# Altium schematic sheet Digital_OUT.SchDoc: Digital outputs
size A3; Organization: ORGANIZATION; Address1: ADDRESS 1; Address2: ADDRESS 2; Address3: ADDRESS 3; Address4: ADDRESS 4; Revision: 0.0; SheetNumber: 10; SheetTotal: 19; ENG_APP_DATE: --/--/--; DSN_APP_DATE: --/--/--; CHK_APP_DATE: --/--/--
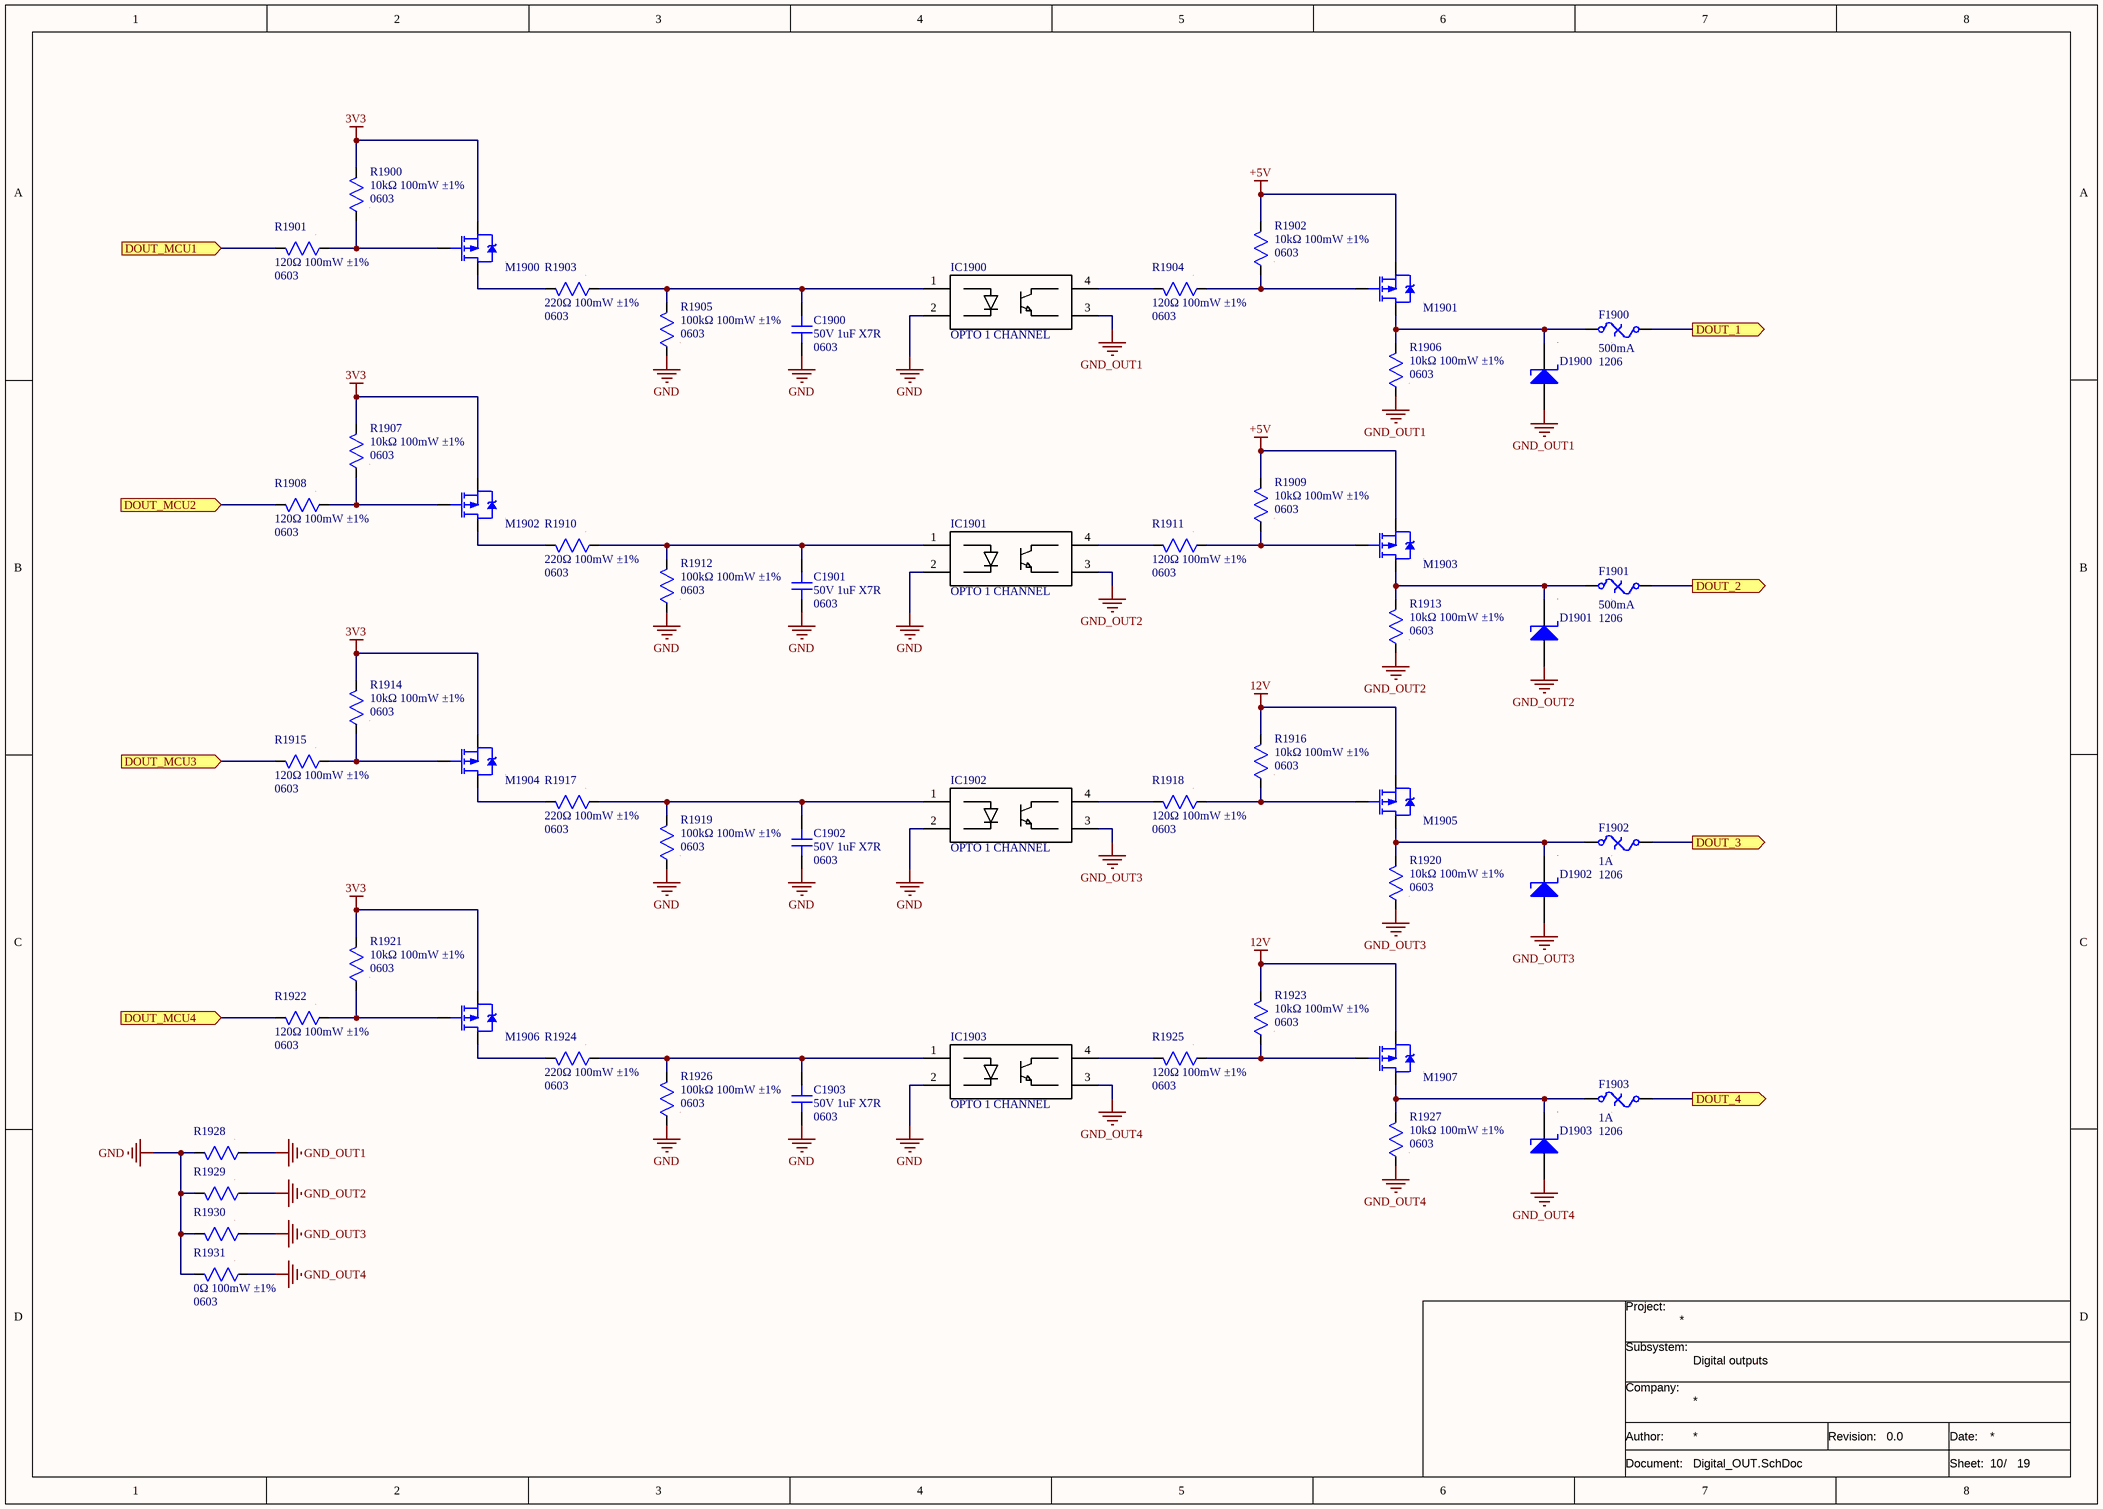
[diagram p0: Digital_OUT.SchDoc]

## Parts
C1900  value 50V 1uF X7R  Package: 0603  [CAP SMD 0603]  (hidden comment: CAP non polarized)
C1901  value 50V 1uF X7R  Package: 0603  [CAP SMD 0603]  (hidden comment: CAP non polarized)
C1902  value 50V 1uF X7R  Package: 0603  [CAP SMD 0603]  (hidden comment: CAP non polarized)
C1903  value 50V 1uF X7R  Package: 0603  [CAP SMD 0603]  (hidden comment: CAP non polarized)
D1900  DIODE SCHOTTKY  [DO-214AB]  (value not drawn)
D1901  DIODE SCHOTTKY  [DO-214AB]  (value not drawn)
D1902  DIODE SCHOTTKY  [DO-214AB]  (value not drawn)
D1903  DIODE SCHOTTKY  [DO-214AB]  (value not drawn)
F1900  value 500mA  Package: 1206  [FUSE SMD 1206]  (hidden comment: FUSE)
F1901  value 500mA  Package: 1206  [FUSE SMD 1206]  (hidden comment: FUSE)
F1902  value 1A  Package: 1206  [FUSE SMD 1206]  (hidden comment: FUSE)
F1903  value 1A  Package: 1206  [FUSE SMD 1206]  (hidden comment: FUSE)
IC1900  OPTO 1 CHANNEL  [SOIC-4]
IC1901  OPTO 1 CHANNEL  [SOIC-4]
IC1902  OPTO 1 CHANNEL  [SOIC-4]
IC1903  OPTO 1 CHANNEL  [SOIC-4]
M1900  MOSFET P  [SOT-23]  (value not drawn)
M1901  MOSFET P  [SOT-23]  (value not drawn)
M1902  MOSFET P  [SOT-23]  (value not drawn)
M1903  MOSFET P  [SOT-23]  (value not drawn)
M1904  MOSFET P  [SOT-23]  (value not drawn)
M1905  MOSFET P  [SOT-23]  (value not drawn)
M1906  MOSFET P  [SOT-23]  (value not drawn)
M1907  MOSFET P  [SOT-23]  (value not drawn)
R1900  value 10kΩ 100mW ±1%  Package: 0603  [RES SMD 0603]  (hidden comment: RES)
R1901  value 120Ω 100mW ±1%  Package: 0603  [RES SMD 0603]  (hidden comment: RES)
R1902  value 10kΩ 100mW ±1%  Package: 0603  [RES SMD 0603]  (hidden comment: RES)
R1903  value 220Ω 100mW ±1%  Package: 0603  [RES SMD 0603]  (hidden comment: RES)
R1904  value 120Ω 100mW ±1%  Package: 0603  [RES SMD 0603]  (hidden comment: RES)
R1905  value 100kΩ 100mW ±1%  Package: 0603  [RES SMD 0603]  (hidden comment: RES)
R1906  value 10kΩ 100mW ±1%  Package: 0603  [RES SMD 0603]  (hidden comment: RES)
R1907  value 10kΩ 100mW ±1%  Package: 0603  [RES SMD 0603]  (hidden comment: RES)
R1908  value 120Ω 100mW ±1%  Package: 0603  [RES SMD 0603]  (hidden comment: RES)
R1909  value 10kΩ 100mW ±1%  Package: 0603  [RES SMD 0603]  (hidden comment: RES)
R1910  value 220Ω 100mW ±1%  Package: 0603  [RES SMD 0603]  (hidden comment: RES)
R1911  value 120Ω 100mW ±1%  Package: 0603  [RES SMD 0603]  (hidden comment: RES)
R1912  value 100kΩ 100mW ±1%  Package: 0603  [RES SMD 0603]  (hidden comment: RES)
R1913  value 10kΩ 100mW ±1%  Package: 0603  [RES SMD 0603]  (hidden comment: RES)
R1914  value 10kΩ 100mW ±1%  Package: 0603  [RES SMD 0603]  (hidden comment: RES)
R1915  value 120Ω 100mW ±1%  Package: 0603  [RES SMD 0603]  (hidden comment: RES)
R1916  value 10kΩ 100mW ±1%  Package: 0603  [RES SMD 0603]  (hidden comment: RES)
R1917  value 220Ω 100mW ±1%  Package: 0603  [RES SMD 0603]  (hidden comment: RES)
R1918  value 120Ω 100mW ±1%  Package: 0603  [RES SMD 0603]  (hidden comment: RES)
R1919  value 100kΩ 100mW ±1%  Package: 0603  [RES SMD 0603]  (hidden comment: RES)
R1920  value 10kΩ 100mW ±1%  Package: 0603  [RES SMD 0603]  (hidden comment: RES)
R1921  value 10kΩ 100mW ±1%  Package: 0603  [RES SMD 0603]  (hidden comment: RES)
R1922  value 120Ω 100mW ±1%  Package: 0603  [RES SMD 0603]  (hidden comment: RES)
R1923  value 10kΩ 100mW ±1%  Package: 0603  [RES SMD 0603]  (hidden comment: RES)
R1924  value 220Ω 100mW ±1%  Package: 0603  [RES SMD 0603]  (hidden comment: RES)
R1925  value 120Ω 100mW ±1%  Package: 0603  [RES SMD 0603]  (hidden comment: RES)
R1926  value 100kΩ 100mW ±1%  Package: 0603  [RES SMD 0603]  (hidden comment: RES)
R1927  value 10kΩ 100mW ±1%  Package: 0603  [RES SMD 0603]  (hidden comment: RES)
R1928  RES  [RES SMD 0603]  (value not drawn)
R1929  RES  [RES SMD 0603]  (value not drawn)
R1930  RES  [RES SMD 0603]  (value not drawn)
R1931  value 0Ω 100mW ±1%  Package: 0603  [RES SMD 0603]  (hidden comment: RES)

## Ports
DOUT_1 (out), DOUT_2 (out), DOUT_3 (out), DOUT_4 (out), DOUT_MCU1 (in), DOUT_MCU2 (in), DOUT_MCU3 (in), DOUT_MCU4 (in)

## Nets
3V3: M1900.2(S) M1902.2(S) M1904.2(S) M1906.2(S) R1900.2 R1907.2 R1914.2 R1921.2
12V: M1905.2(S) M1907.2(S) R1916.2 R1923.2
+5V: M1901.2(S) M1903.2(S) R1902.2 R1909.2
GND: C1900.2 C1901.2 C1902.2 C1903.2 IC1900.2(K_1) IC1901.2(K_1) IC1902.2(K_1) IC1903.2(K_1) R1905.1 R1912.1 R1919.1 R1926.1 R1928.2 R1929.2 R1930.2 R1931.2
GND_OUT1: D1900.A IC1900.3(E_1) R1906.1 R1928.1
GND_OUT2: D1901.A IC1901.3(E_1) R1913.1 R1929.1
GND_OUT3: D1902.A IC1902.3(E_1) R1920.1 R1930.1
GND_OUT4: D1903.A IC1903.3(E_1) R1927.1 R1931.1
DOUT_1: F1900.2 ; port DOUT_1
DOUT_2: F1901.2 ; port DOUT_2
DOUT_3: F1902.2 ; port DOUT_3
DOUT_4: F1903.2 ; port DOUT_4
DOUT_MCU1: R1901.2 ; port DOUT_MCU1
DOUT_MCU2: R1908.2 ; port DOUT_MCU2
DOUT_MCU3: R1915.2 ; port DOUT_MCU3
DOUT_MCU4: R1922.2 ; port DOUT_MCU4
NetC1900_1: C1900.1 IC1900.1(A_1) R1903.1 R1905.2
NetC1901_1: C1901.1 IC1901.1(A_1) R1910.1 R1912.2
NetC1902_1: C1902.1 IC1902.1(A_1) R1917.1 R1919.2
NetC1903_1: C1903.1 IC1903.1(A_1) R1924.1 R1926.2
NetD1900_K: D1900.K F1900.1 M1901.3(D) R1906.2
NetD1901_K: D1901.K F1901.1 M1903.3(D) R1913.2
NetD1902_K: D1902.K F1902.1 M1905.3(D) R1920.2
NetD1903_K: D1903.K F1903.1 M1907.3(D) R1927.2
NetIC1900_4: IC1900.4(C_1) R1904.2
NetIC1901_4: IC1901.4(C_1) R1911.2
NetIC1902_4: IC1902.4(C_1) R1918.2
NetIC1903_4: IC1903.4(C_1) R1925.2
NetM1900_1: M1900.1(G) R1900.1 R1901.1
NetM1900_3: M1900.3(D) R1903.2
NetM1901_1: M1901.1(G) R1902.1 R1904.1
NetM1902_1: M1902.1(G) R1907.1 R1908.1
NetM1902_3: M1902.3(D) R1910.2
NetM1903_1: M1903.1(G) R1909.1 R1911.1
NetM1904_1: M1904.1(G) R1914.1 R1915.1
NetM1904_3: M1904.3(D) R1917.2
NetM1905_1: M1905.1(G) R1916.1 R1918.1
NetM1906_1: M1906.1(G) R1921.1 R1922.1
NetM1906_3: M1906.3(D) R1924.2
NetM1907_1: M1907.1(G) R1923.1 R1925.1

## Notes on the sheet
- Project:
- Subsystem:
- Company:
- Document:
- Author:
- Revision:
- Date:
- Sheet:
- /

## Library data of the parts
C1900-C1903 = 001-0102: Condensadores de cerámica multicapa (MLCC- SMD/SMT) WCAP-CSGP 1uF 50 Vol 10%; MPN: 885012206126; Manufacturer: Wurth Elektronik; ComponentLink1Description: Datasheet; ComponentLink1URL: https://www.we-online.com/components/products/datasheet/885012206126.pdf; ComponentLink2Description: Distributor Link; ComponentLink2URL: https://www.mouser.es/ProductDetail/Wurth-Elektronik/885012206126?qs=amGC7iS6iy%2F%252BJOLb%2FSuwig%3D%3D; ID: 001-0102; Distributor PN: 710-885012206126; Distributor: Mouser
D1900-D1903 = 031-0013: Diodos y rectificadores Schottky 3A 60V; MPN: MBRS360T3G; Manufacturer: onsemi; Value: 60V 3A; ComponentLink1Description: Datasheet; ComponentLink1URL: https://www.onsemi.com/pdf/datasheet/mbrs360t3-d.pdf; ComponentLink2Description: Distributor Link; ComponentLink2URL: https://www.mouser.es/ProductDetail/onsemi/MBRS360T3G?qs=3JMERSakebpuPnGIg0cvPA%3D%3D; ID: 031-0013; Package: DO-214AB; Distributor PN: 863-MBRS360T3G; Distributor: Mouser
F1900 F1901 = 040-0024: Fusibles de montaje en superficie 1206 0.5AMPS SMD; MPN: F1206B0R50FSTR; Manufacturer: Littelfuse; ComponentLink1Description: Datasheet; ComponentLink1URL: https://datasheets.kyocera-avx.com/AccuGuard2.pdf; ComponentLink2Description: Distributor Link; ComponentLink2URL: https://www.mouser.es/ProductDetail/KYOCERA-AVX/F1206B0R50FSTR?qs=hZPoALHhU4OC%2FuvTP6tvGA%3D%3D; ID: 040-0024; Distributor PN: 581-F1206B0R50FSTR; Distributor: Mouser
F1902 F1903 = 040-0023: Fusibles de montaje en superficie 63V 1A FA HALIDE FREE SLIM; MPN: 0466001.NRHF; Manufacturer: Littelfuse; ComponentLink1Description: Datasheet; ComponentLink1URL: https://www.littelfuse.com/assetdocs/littelfuse_fuse_466_datasheet?assetguid=dbe9bcd7-6072-4adf-bf5b-d33e52a6b90f; ComponentLink2Description: Distributor Link; ComponentLink2URL: https://www.mouser.es/ProductDetail/Littelfuse/0466001.NRHF?qs=n5MbhIql%252BRl7ALFy%2FbHisA%3D%3D; ID: 040-0023; Distributor PN: 576-0466001.NRHF; Distributor: Mouser
IC1900-IC1903 = 041-0001: Optoacopladores para salidas de transistores Automotive DC-input transistor-output s; MPN: ISOM8110DFHRQ1; Manufacturer: Texas Instruments; ComponentLink1Description: Datasheet; ComponentLink1URL: https://www.ti.com/lit/ds/symlink/isom8118-q1.pdf?ts=1782232586415&ref_url=https%253A%252F%252Fwww.mouser.es%252F; ComponentLink2Description: Distributor Link; ComponentLink2URL: https://www.mouser.es/ProductDetail/Texas-Instruments/ISOM8110DFHRQ1?qs=7%2F6SraaimPTj7eqPn2eA2w%3D%3D; ID: 041-0001; Value: -; Package: SOIC-4; Distributor PN: 595-ISOM8110DFHRQ1; Distributor: Mouser
M1900-M1907 = 043-0002: MOSFET -30V Vds 20V Vgs SOT-23; MPN: SI2303CDS-T1-GE3; Manufacturer: Vishay Semiconductors; ComponentLink1Description: Datasheet; ComponentLink1URL: https://www.vishay.com/docs/69991/si2303cd.pdf; ComponentLink2Description: Distributor Link; ComponentLink2URL: https://www.mouser.es/ProductDetail/Vishay-Semiconductors/SI2303CDS-T1-GE3?qs=IRuQNBqMOckJHxNXLRBkmw%3D%3D; ID: 043-0002; Value: P; Package: SOT-23-3; Distributor PN: 781-SI2303CDS-T1-GE3; Distributor: Mouser
R1900 R1902 R1906 R1907 R1909 R1913 R1914 R1916 R1920 R1921 R1923 R1927 = 010-0145: Resistores de película gruesa - SMD WRIS-RSKS 10 kOhms 1 % 0.1 W 0603 AEC-Q200; MPN: 560112116005; Manufacturer: Wurth Elektronik; ComponentLink1Description: Datasheet; ComponentLink1URL: https://www.we-online.com/components/products/datasheet/560112116005.pdf; ComponentLink2Description: Distributor Link; ComponentLink2URL: https://www.mouser.es/ProductDetail/Wurth-Elektronik/560112116005?qs=mELouGlnn3dMVSPHwBGouA%3D%3D; ID: 010-0145; Distributor PN: 710-560112116005; Distributor: Mouser
R1901 R1904 R1908 R1911 R1915 R1918 R1922 R1925 = 010-0177: Resistores de película gruesa - SMD WRIS-RSKS 120 Ohms 1 % 0.1 W 0603 AEC-Q200; MPN: 560112116119; Manufacturer: Wurth Elektronik; ComponentLink1Description: Datasheet; ComponentLink1URL: https://www.we-online.com/components/products/datasheet/560112116119.pdf; ComponentLink2Description: Distributor Link; ComponentLink2URL: https://www.mouser.es/ProductDetail/Wurth-Elektronik/560112116119?qs=mELouGlnn3eT%2F22oIMY8Ng%3D%3D; ID: 010-0177; Distributor PN: 710-560112116119; Distributor: Mouser
R1903 R1910 R1917 R1924 = 010-0191: Resistores de película gruesa - SMD WRIS-RSKS 220 Ohms 1 % 0.1 W 0603 AEC-Q200; MPN: 560112116126; Manufacturer: Wurth Elektronik; ComponentLink1Description: Datasheet; ComponentLink1URL: https://www.we-online.com/components/products/datasheet/560112116126.pdf; ComponentLink2Description: Distributor Link; ID: 010-0191; Distributor PN: 710-560112116126; Distributor: Mouser
R1905 R1912 R1919 R1926 = 010-0190: Thick Film Resistors WRIS-RSKS 100 kOhms 1 % 0.1 W 0603 AEC-Q200; MPN: 560112116004; Manufacturer: Wurth Elektronik; ComponentLink1Description: Datasheet; ComponentLink1URL: https://www.we-online.com/components/products/datasheet/560112116004.pdf; ComponentLink2Description: Distributor Link; ComponentLink2URL: https://www.mouser.es/ProductDetail/Wurth-Elektronik/560112116004?qs=sGAEpiMZZMvdGkrng054txLI%2FDB4oIKDB%252BmfBE1ySSGuQklCN21gzA%3D%3D; ID: 010-0190; Distributor PN: 710-560112116004; Distributor: Mouser
R1928-R1930 = 010-0160: Resistores de película gruesa - SMD WRIS-RSKS <0.05 Ohms 0.1 W Jumper 0603 AEC-Q200; MPN: 560112116001; Manufacturer: Wurth Elektronik; Value: 0Ω 100mW ±1%; ComponentLink1Description: Datasheet; ComponentLink1URL: https://www.we-online.com/components/products/datasheet/560112116001.pdf; ComponentLink2Description: Distributor Link; ComponentLink2URL: https://www.mouser.es/ProductDetail/Wurth-Elektronik/560112116001?qs=mELouGlnn3dlnHYj7TecuA%3D%3D; Package: 0603; ID: 010-0160; Distributor PN: 710-560112116001; Distributor: Mouser
R1931 = 010-0160: Resistores de película gruesa - SMD WRIS-RSKS <0.05 Ohms 0.1 W Jumper 0603 AEC-Q200; MPN: 560112116001; Manufacturer: Wurth Elektronik; ComponentLink1Description: Datasheet; ComponentLink1URL: https://www.we-online.com/components/products/datasheet/560112116001.pdf; ComponentLink2Description: Distributor Link; ComponentLink2URL: https://www.mouser.es/ProductDetail/Wurth-Elektronik/560112116001?qs=mELouGlnn3dlnHYj7TecuA%3D%3D; ID: 010-0160; Distributor PN: 710-560112116001; Distributor: Mouser